# EAGLE design schematic gps (EAGLE 9.6.2)
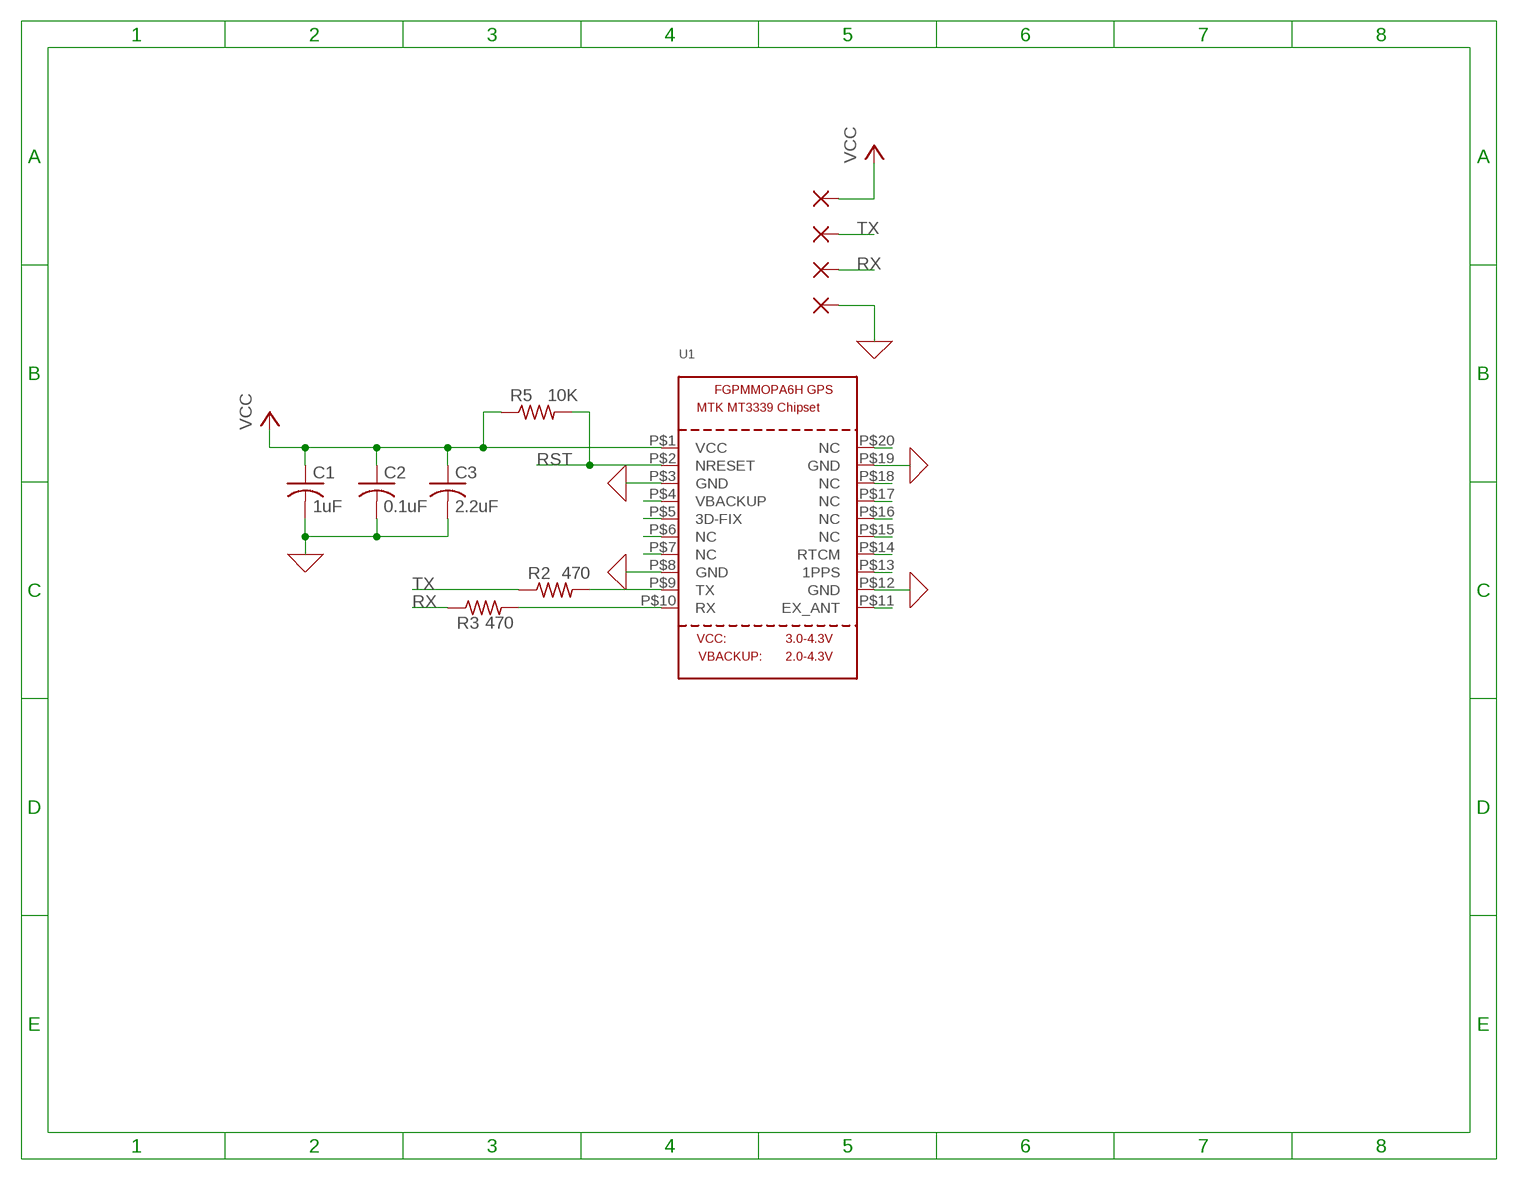
[diagram p0: schematic, sheet 1]

## Parts
C1  1uF  C-USC0805  [C0805]
C2  0.1uF  C-USC0805  [C0805]
C3  2.2uF  C-USC0805  [C0805]
GND  WIREPADSMD1,27-254  [SMD1,27-2,54]
R2  470  R-US_R0805  [R0805]
R3  470  R-US_R0805  [R0805]
R5  10K  R-US_R0805  [R0805]
RX  WIREPADSMD1,27-254  [SMD1,27-2,54]
TX  WIREPADSMD1,27-254  [SMD1,27-2,54]
U1  GPS_FGPMMOPA6H  [FGPMMOPA6H]
VCC  WIREPADSMD1,27-254  [SMD1,27-2,54]

## Nets
0: C1.2 C2.2 C3.2 GND.1(P) U1.P$3(GND) U1.P$8(GND) U1.P$12(GND) U1.P$19(GND) ; supply symbol labelled GND
N$1: U1.P$5(3D-FIX)
N$2: U1.P$4(VBACKUP)
N$3: U1.P$6(NC)
N$4: U1.P$7(NC)
N$6: R2.2 U1.P$9(TX)
N$7: R3.2 U1.P$10(RX)
N$8: U1.P$20(NC)
N$10: U1.P$18(NC)
N$11: U1.P$17(NC)
N$12: U1.P$16(NC)
N$13: U1.P$15(NC)
N$14: U1.P$14(RTCM)
N$15: U1.P$13(1PPS)
N$17: U1.P$11(EX_ANT)
RST: R5.2 U1.P$2(NRESET)
RX: R3.1 RX.1(P)
TX: R2.1 TX.1(P)
VCC: C1.1 C2.1 C3.1 R5.1 U1.P$1(VCC) VCC.1(P)

## Library data of the parts
C1-C3 = rcl:C-US: CAPACITOR, American symbol; SPICEPREFIX: C
GND RX TX VCC = wirepad:WIREPAD: Wire PAD connect wire on PCB
R2 R3 R5 = rcl:R-US_: RESISTOR, American symbol; SPICEPREFIX: R
U1 = adafruit:GPS_FGPMMOPA6H: GPS Module - MTK MT3339 Chipset, -165dBm sensitivity, 22 channels, 10Hz, auto-select external antenna options; SPICEPREFIX: X

## Board
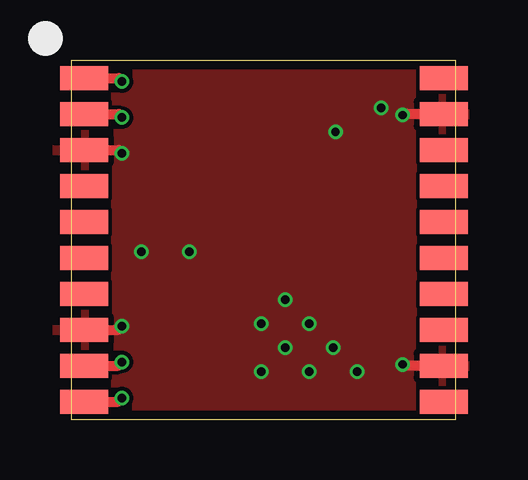
[diagram p1: board, top side]
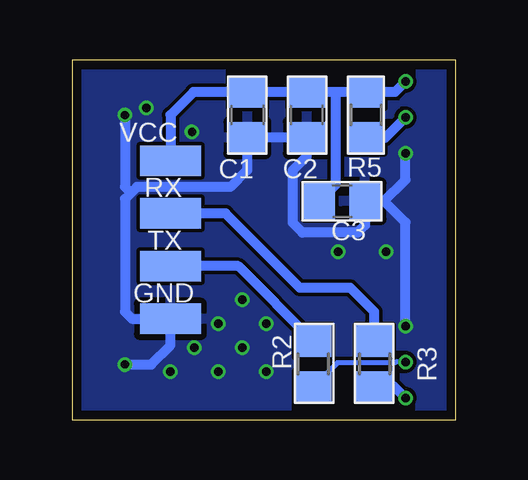
[diagram p2: board, bottom side, seen from below]

Size 16 x 15 mm. Coordinates in mm from the lower left corner, seen from the top.
Outline: 16,0 0,0 0,15 16,15 16,0
Copper layers (1*16): Top 0.035559375mm / dielectric 1.6mm / Bottom 0.035559375mm
Design rules "oshpark-2layer": minimum track width 6mil, minimum drill 10mil, track to track 6mil, track to pad 6mil, pad to pad 6mil, via to via 6mil, smd to smd 6mil, copper to edge 15mil, drill to drill 6mil, minimum pad ring 5mil, minimum via ring 5mil, stop-mask expansion 2.5mil, vias tented up to drill 0mil, thermal gap 10mil

### Footprints (pad centres in the part's own frame; a part is rotated, then mirrored left to right if it is on the bottom)
C0805 = smd 1.3 x 1.5: 1 -0.95,0; 2 0.95,0
SMD1,27-2,54 = smd 1.27 x 2.54: 1 0,0
R0805 = smd 1.3 x 1.5: 1 -0.95,0; 2 0.95,0
FGPMMOPA6H = smd 2 x 1: P$1 -7.5,6.75; P$2 -7.5,5.25; P$3 -7.5,3.75; P$4 -7.5,2.25; P$5 -7.5,0.75; P$6 -7.5,-0.75; P$7 -7.5,-2.25; P$8 -7.5,-3.75; P$9 -7.5,-5.25; P$10 -7.5,-6.75; P$11 7.5,-6.75; P$12 7.5,-5.25; P$13 7.5,-3.75; P$14 7.5,-2.25; P$15 7.5,-0.75; P$16 7.5,0.75; P$17 7.5,2.25; P$18 7.5,3.75; P$19 7.5,5.25; P$20 7.5,6.75

### Placement (x,y rotation side)
C1  8.69,12.71 270 bottom
C2  6.22,12.71 270 bottom
C3  4.74,9.11 0 bottom
GND  11.9,4.2 90 bottom
R2  5.94,2.32 270 bottom
R3  3.39,2.32 270 bottom
R5  3.74,12.71 270 bottom
RX  11.9,8.6 90 bottom
TX  11.9,6.4 90 bottom
U1  8.01,7.49 0 top
VCC  11.9,10.8 90 bottom

### Tracks (layer width: path | path; a pad name or v marks a point on that pad's centre or on a via)
0  (via drill 0.35)
  Top 0.406: U1.P$3 1.96,11.24 v2.1,11.1 | U1.P$12 13.86,2.24 v13.8,2.3 | U1.P$19 13.84,12.74 v13.8,12.7 | U1.P$8 1.94,3.74 v2.1,3.9
  Bottom 0.406: v13.8,2.3 12.7,2.3 11.9,3.1 GND.1 13.5,4.2 13.8,4.5 13.8,9.2 13.55,9.45 | 2.99,9.11 C3.2 3.79,8.11 4.1,7.8 6.4,7.8 6.8,8.2 6.8,10.4 6.22,10.98 C2.2 | 2.99,9.11 2.1,10 v2.1,11.1 | C2.2 | C2.2 C1.2 8.7,10.4 9.4,9.7 13.3,9.7 13.55,9.45 | v2.1,3.9 2.1,8.22 2.99,9.11 | v13.8,12.7 13.8,9.7 13.55,9.45
  other vias: 2.9,7 7.9,4 8.9,5 8.9,3 7.9,2 9.9,2 9.9,4 10.9,3 11.9,2 4.9,7 11,12 12.9,13
  pour Bottom: -0.6,15.5 16.4,15.5 16.4,-0.5 -0.6,-0.5
  pour Top: -0.6,-0.5 16.4,-0.5 16.4,15.5 -0.6,15.5
N$6  (via drill 0.35)
  Top 0.406: U1.P$9 1.94,2.24 v2.1,2.4
  Bottom 0.203: v2.1,2.4 2.5,2.4 2.53,2.37 4.94,2.37 R2.2
N$7  (via drill 0.35)
  Top 0.406: U1.P$10 1.94,0.74 v2.1,0.9
  Bottom 0.406: v2.1,0.9 2.57,1.37 R3.2
RST  (via drill 0.35)
  Top 0.406: U1.P$2 1.96,12.74 v2.1,12.6
  Bottom 0.406: v2.1,12.6 2.94,11.76 R5.2
RX
  Bottom 0.406: R3.1 3.4,4.5 4.4,5.5 6.5,5.5 9.6,8.6 RX.1
TX
  Bottom 0.406: R2.1 9.07,6.4 TX.1
VCC  (via drill 0.35)
  Top 0.406: U1.P$1 1.96,14.24 v2.1,14.1
  Bottom 0.406: v2.1,14.1 2.54,13.66 R5.1 5,13.66 | 5,13.66 C2.1 C1.1 | C1.1 | C1.1 10.94,13.66 11.9,12.7 VCC.1 | C3.1 5,9.8 5,13.66